# Altium schematic sheet 01_GAP_POWER.SchDoc: SENSEI Base Board - GAP Power
size A3; DrawnBy: Sebastian Frey; Organization: Integrated Systems Laboratory; DocumentNumber: 2; Revision: v1.0; SheetNumber: 2; SheetTotal: 12
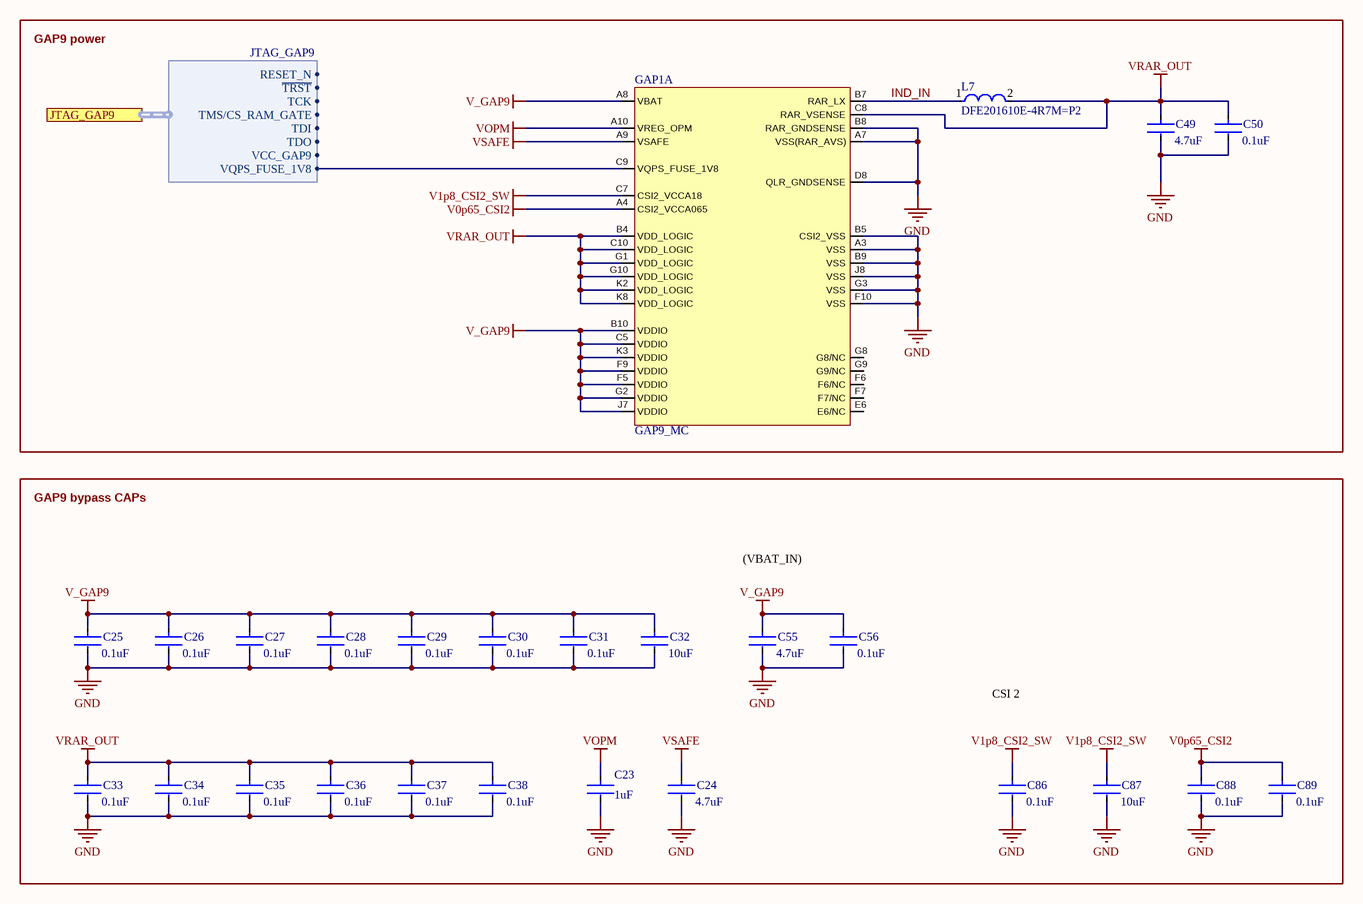
[diagram p0: 01_GAP_POWER.SchDoc]

## Parts
C23  Capacitance: 1uF  [FP-CL03-IPC_B]  (hidden comment: CL03A105KP3NSNC)
C24  Capacitance: 4.7uF  [FP-C1005-050-0_15-IPC_B]  (hidden comment: C1005X5R0J475K050BC)
C25  Capacitance: 0.1uF  [FP-GRM033-0_03-IPC_B]  (hidden comment: GRM033Z71C104KE14D)
C26  Capacitance: 0.1uF  [FP-GRM033-0_03-IPC_B]  (hidden comment: GRM033Z71C104KE14D)
C27  Capacitance: 0.1uF  [FP-GRM033-0_03-IPC_B]  (hidden comment: GRM033Z71C104KE14D)
C28  Capacitance: 0.1uF  [FP-GRM033-0_03-IPC_B]  (hidden comment: GRM033Z71C104KE14D)
C29  Capacitance: 0.1uF  [FP-GRM033-0_03-IPC_B]  (hidden comment: GRM033Z71C104KE14D)
C30  Capacitance: 0.1uF  [FP-GRM033-0_03-IPC_B]  (hidden comment: GRM033Z71C104KE14D)
C31  Capacitance: 0.1uF  [FP-GRM033-0_03-IPC_B]  (hidden comment: GRM033Z71C104KE14D)
C32  Capacitance: 10uF  [FP-CL05A106MP5NUNC-IPC_B]  (hidden comment: CL05A106MP5NUNC)
C33  Capacitance: 0.1uF  [FP-GRM033-0_03-IPC_B]  (hidden comment: GRM033Z71C104KE14D)
C34  Capacitance: 0.1uF  [FP-GRM033-0_03-IPC_B]  (hidden comment: GRM033Z71C104KE14D)
C35  Capacitance: 0.1uF  [FP-GRM033-0_03-IPC_B]  (hidden comment: GRM033Z71C104KE14D)
C36  Capacitance: 0.1uF  [FP-GRM033-0_03-IPC_B]  (hidden comment: GRM033Z71C104KE14D)
C37  Capacitance: 0.1uF  [FP-GRM033-0_03-IPC_B]  (hidden comment: GRM033Z71C104KE14D)
C38  Capacitance: 0.1uF  [FP-GRM033-0_03-IPC_B]  (hidden comment: GRM033Z71C104KE14D)
C49  Capacitance: 4.7uF  [FP-C1005-050-0_15-IPC_B]  (hidden comment: C1005X5R0J475K050BC)
C50  Capacitance: 0.1uF  [FP-GRM033-0_03-IPC_B]  (hidden comment: GRM033Z71C104KE14D)
C55  Capacitance: 4.7uF  [FP-C1005-050-0_15-IPC_B]  (hidden comment: C1005X5R0J475K050BC)
C56  Capacitance: 0.1uF  [FP-GRM033-0_03-IPC_B]  (hidden comment: GRM033Z71C104KE14D)
C86  Capacitance: 0.1uF  [FP-GRM033-0_03-IPC_B]  (hidden comment: GRM033Z71C104KE14D)
C87  Capacitance: 10uF  [FP-CL05A106MP5NUNC-IPC_B]  (hidden comment: CL05A106MP5NUNC)
C88  Capacitance: 0.1uF  [FP-GRM033-0_03-IPC_B]  (hidden comment: GRM033Z71C104KE14D)
C89  Capacitance: 0.1uF  [FP-GRM033-0_03-IPC_B]  (hidden comment: GRM033Z71C104KE14D)
GAP1  GAP9_MC  [GAP9]  (part A of 5)
L7  DFE201610E-4R7M=P2  [FP-DFE201610C-MFG]

## Blocks framed on the sheet
GAP9 power: C49 C50 GAP1 L7
GAP9 bypass CAPs: C23-C38 C55 C56 C86-C89

## Ports
JTAG_GAP9 (harness JTAG_GAP9)

## Harnesses
JTAG_GAP9: ~{TRST}, TCK, TMS/CS_RAM_GATE, TDI, TDO, VCC_GAP9, RESET_N, VQPS_FUSE_1V8

## Nets
GND: C23.2 C24.2 C25.2 C26.2 C27.2 C28.2 C29.2 C30.2 C31.2 C32.2 C33.2 C34.2 C35.2 C36.2 C37.2 C38.2 C49.2 C50.2 C55.2 C56.2 C86.2 C87.2 C88.2 C89.2 GAP1.A3(VSS) GAP1.A7(VSS(RAR_AVS)) GAP1.B5(CSI2_VSS) GAP1.B8(RAR_GNDSENSE) GAP1.B9(VSS) GAP1.D8(QLR_GNDSENSE) GAP1.F10(VSS) GAP1.G3(VSS) GAP1.J8(VSS)
V0p65_CSI2: C88.1 C89.1 GAP1.A4(CSI2_VCCA065)
V1p8_CSI2_SW: C86.1 C87.1 GAP1.C7(CSI2_VCCA18)
V_GAP9: C25.1 C26.1 C27.1 C28.1 C29.1 C30.1 C31.1 C32.1 C55.1 C56.1 GAP1.A8(VBAT) GAP1.B10(VDDIO) GAP1.C5(VDDIO) GAP1.F5(VDDIO) GAP1.F9(VDDIO) GAP1.G2(VDDIO) GAP1.J7(VDDIO) GAP1.K3(VDDIO)
VOPM: C23.1 GAP1.A10(VREG_OPM)
VRAR_OUT: C33.1 C34.1 C35.1 C36.1 C37.1 C38.1 C49.1 C50.1 GAP1.B4(VDD_LOGIC) GAP1.C8(RAR_VSENSE) GAP1.C10(VDD_LOGIC) GAP1.G1(VDD_LOGIC) GAP1.G10(VDD_LOGIC) GAP1.K2(VDD_LOGIC) GAP1.K8(VDD_LOGIC) L7.2
VSAFE: C24.1 GAP1.A9(VSAFE)
IND_IN: GAP1.B7(RAR_LX) L7.1
NetGAP1_C9: GAP1.C9(VQPS_FUSE_1V8) ; port JTAG_GAP9.VQPS_FUSE_1V8

Not connected (* = marked no-connect by the designer): GAP1 E6(E6/NC) F6(F6/NC) F7(F7/NC) G8(G8/NC) G9(G9/NC)

## Notes on the sheet
- (VBAT_IN)
- CSI 2
- 1
- 2
- 3
- 4
- 5
- 6
- 7
- 8
- A
- B
- C
- D
- Project:
- Date:
- Drawing number:
- Rev:
- Format:
- A3
- Drawn by:
- Laboratory:
- Page
- Sheet:
- of
- File:

## Library data of the parts
C23 = CMP-13271-003594-1: Cap Ceramic 1uF 10V X5R ±10% Pad SMD 0201 +85°C T/R; Min Operating Temperature: -55°C; Mount: Surface Mount; Packaging: Cut Tape; Width: 0.012inch; Tolerance: 10%; Case Code (Imperial): 0201; Thickness: 0.013inch; Length: 0.024inch; Case/Package: 0201; Max Operating Temperature: 85°C; Voltage Rating: 10V; Case Code (Metric): 0603
C24 C49 C55 = CMP-2000-05437-2: CAP CER 4.7UF 6.3V X5R 0402; Tolerance: 10%; Dielectric Material: Ceramic; Voltage: 6.3V; Depth: 0.5mm; Height: 0.5mm; Length: 1mm; Termination: SMD/SMT; RoHS Compliant: Yes; Series: C; Case/Package: 0402; Dielectric: X5R; Lead Free: Lead Free; Mount: Surface Mount; Max Operating Temperature: 85°C; Min Operating Temperature: -55°C
C25-C31 C33-C38 C50 C56 C86 C88 C89 = CMP-06035-035508-1: Chip Multilayer Ceramic Capacitors for General Purpose, 0201, 0.10uF, X7R, 15%, 10%, 16V; Case/Package: 0201
C32 C87 = CMP-13271-000002-1: CAP CER 10UF 10V X5R 0402; Manufacturer: Samsung; Temperature Coefficient: 15%; Tolerance: 20%; Material: Ceramic; Octopart: https://octopart.com/cl05a106mp5nunc-samsung-22457395; Voltage Rating: 10V; RoHS: TRUE; Value: 10uF; Height: 0.7mm; Digikey Description: CAP CER 10UF 10V X5R 0402; Automotive: No; Package: CL05A106MP5NUNC; Device Class L1: Passive Components; Temperature Range High: +85°C; ComponentLink2Description: Datasheet; Device Class L2: Capacitors; Temperature Characteristic: X5R; Manufacturer Part Number: CL05A106MP5NUNC; Temperature: -55°C to +85°C; ComponentLink2URL: http://www.samsungsem.com/kr/support/product-search/mlcc/__icsFiles/afieldfile/2019/05/10/19-CL05A106MP5NUNC.pdf; Device Class L3: Ceramic Capacitors; Category: Cap; Temperature Range Low: -55°C; Ipc Land Pattern Name: CAPC10050X50; Lead Free: Yes
L7 = CMP-06042-006199-1: Shielded Wirewound Inductor 4.7uH 20% 1100mA 0.288Ω 0806 (2016)